# Altium schematic sheet Compute 5 Top Configuration.SchDoc
size A3; SheetNumber: 7; SheetTotal: 7
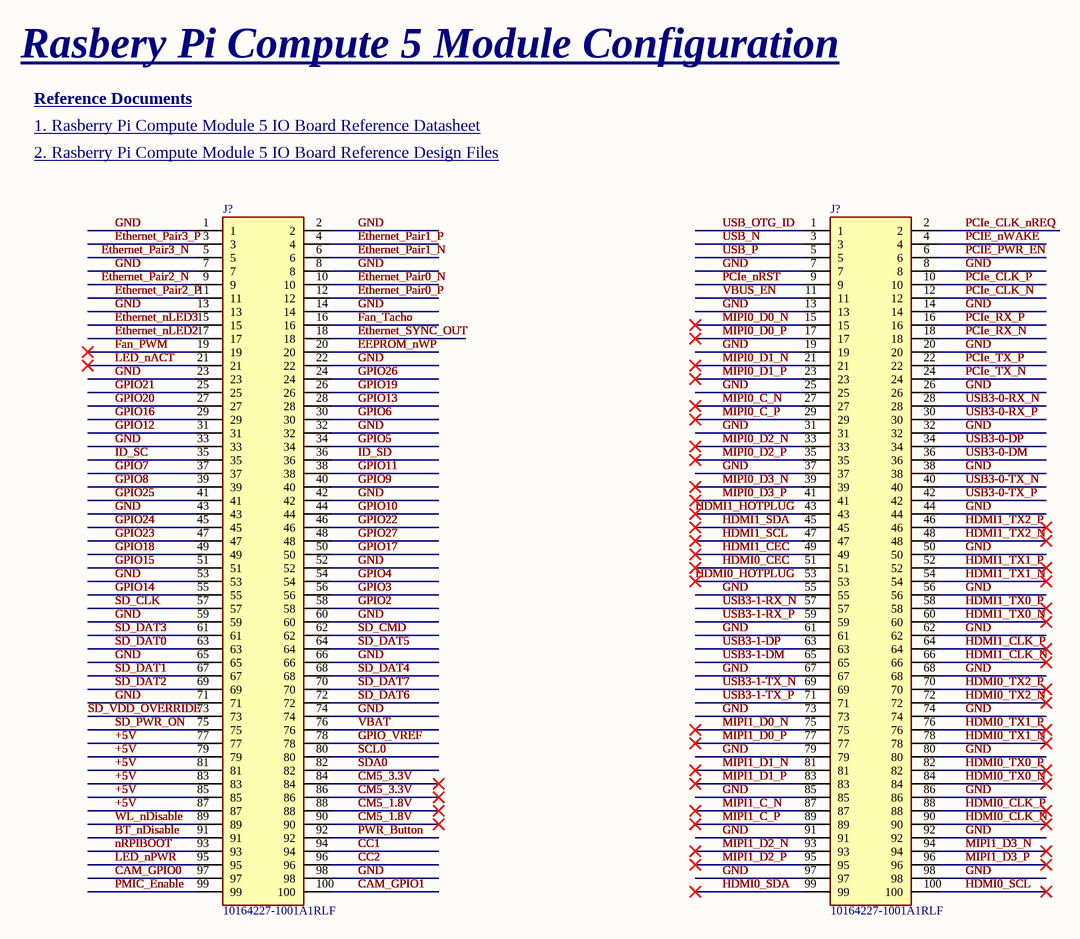
[diagram p0: Compute 5 Top Configuration.SchDoc]

## Parts
(Parts that share a designator on the sheet are numbered #1, #2 ... from top to bottom, then left to right.)
J?#1  10164227-1001A1RLF  [101642271001A1RLF]
J?#2  10164227-1001A1RLF  [101642271001A1RLF]

## Nets
+5V: J?#1.77 J?#1.79 J?#1.81 J?#1.83 J?#1.85 J?#1.87
BT_nDisable: J?#1.91
CAM_GPIO0: J?#1.97
CAM_GPIO1: J?#1.100
CC1: J?#1.94
CC2: J?#1.96
CM5_1.8V: J?#1.88 J?#1.90
CM5_3.3V: J?#1.84 J?#1.86
EEPROM_nWP: J?#1.20
Ethernet_nLED2: J?#1.17
Ethernet_nLED3: J?#1.15
Ethernet_Pair0_N: J?#1.10
Ethernet_Pair0_P: J?#1.12
Ethernet_Pair1_N: J?#1.6
Ethernet_Pair1_P: J?#1.4
Ethernet_Pair2_N: J?#1.9
Ethernet_Pair2_P: J?#1.11
Ethernet_Pair3_N: J?#1.5
Ethernet_Pair3_P: J?#1.3
Ethernet_SYNC_OUT: J?#1.18
Fan_PWM: J?#1.19
Fan_Tacho: J?#1.16
GND: J?#1.1 J?#1.2 J?#1.7 J?#1.8 J?#1.13 J?#1.14 J?#1.22 J?#1.23 J?#1.32 J?#1.33 J?#1.42 J?#1.43 J?#1.52 J?#1.53 J?#1.59 J?#1.60 J?#1.65 J?#1.66 J?#1.71 J?#1.74 J?#1.98 J?#2.7 J?#2.8 J?#2.13 J?#2.14 J?#2.19 J?#2.20 J?#2.25 J?#2.26 J?#2.31 J?#2.32 J?#2.37 J?#2.38 J?#2.44 J?#2.50 J?#2.55 J?#2.56 J?#2.61 J?#2.62 J?#2.67 J?#2.68 J?#2.73 J?#2.74 J?#2.79 J?#2.80 J?#2.85 J?#2.86 J?#2.91 J?#2.92 J?#2.97 J?#2.98
GPIO2: J?#1.58
GPIO3: J?#1.56
GPIO4: J?#1.54
GPIO5: J?#1.34
GPIO6: J?#1.30
GPIO7: J?#1.37
GPIO8: J?#1.39
GPIO9: J?#1.40
GPIO10: J?#1.44
GPIO11: J?#1.38
GPIO12: J?#1.31
GPIO13: J?#1.28
GPIO14: J?#1.55
GPIO15: J?#1.51
GPIO16: J?#1.29
GPIO17: J?#1.50
GPIO18: J?#1.49
GPIO19: J?#1.26
GPIO20: J?#1.27
GPIO21: J?#1.25
GPIO22: J?#1.46
GPIO23: J?#1.47
GPIO24: J?#1.45
GPIO25: J?#1.41
GPIO26: J?#1.24
GPIO27: J?#1.48
GPIO_VREF: J?#1.78
HDMI0_CEC: J?#2.51
HDMI0_CLK_N: J?#2.90
HDMI0_CLK_P: J?#2.88
HDMI0_HOTPLUG: J?#2.53
HDMI0_SCL: J?#2.100
HDMI0_SDA: J?#2.99
HDMI0_TX0_N: J?#2.84
HDMI0_TX0_P: J?#2.82
HDMI0_TX1_N: J?#2.78
HDMI0_TX1_P: J?#2.76
HDMI0_TX2_N: J?#2.72
HDMI0_TX2_P: J?#2.70
HDMI1_CEC: J?#2.49
HDMI1_CLK_N: J?#2.66
HDMI1_CLK_P: J?#2.64
HDMI1_HOTPLUG: J?#2.43
HDMI1_SCL: J?#2.47
HDMI1_SDA: J?#2.45
HDMI1_TX0_N: J?#2.60
HDMI1_TX0_P: J?#2.58
HDMI1_TX1_N: J?#2.54
HDMI1_TX1_P: J?#2.52
HDMI1_TX2_N: J?#2.48
HDMI1_TX2_P: J?#2.46
ID_SC: J?#1.35
ID_SD: J?#1.36
LED_nACT: J?#1.21
LED_nPWR: J?#1.95
MIPI0_C_N: J?#2.27
MIPI0_C_P: J?#2.29
MIPI0_D0_N: J?#2.15
MIPI0_D0_P: J?#2.17
MIPI0_D1_N: J?#2.21
MIPI0_D1_P: J?#2.23
MIPI0_D2_N: J?#2.33
MIPI0_D2_P: J?#2.35
MIPI0_D3_N: J?#2.39
MIPI0_D3_P: J?#2.41
MIPI1_C_N: J?#2.87
MIPI1_C_P: J?#2.89
MIPI1_D0_N: J?#2.75
MIPI1_D0_P: J?#2.77
MIPI1_D1_N: J?#2.81
MIPI1_D1_P: J?#2.83
MIPI1_D2_N: J?#2.93
MIPI1_D2_P: J?#2.95
MIPI1_D3_N: J?#2.94
MIPI1_D3_P: J?#2.96
nRPIBOOT: J?#1.93
PCIe_CLK_N: J?#2.12
PCIe_CLK_nREQ: J?#2.2
PCIe_CLK_P: J?#2.10
PCIe_nRST: J?#2.9
PCIE_nWAKE: J?#2.4
PCIE_PWR_EN: J?#2.6
PCIe_RX_N: J?#2.18
PCIe_RX_P: J?#2.16
PCIe_TX_N: J?#2.24
PCIe_TX_P: J?#2.22
PMIC_Enable: J?#1.99
PWR_Button: J?#1.92
SCL0: J?#1.80
SD_CLK: J?#1.57
SD_CMD: J?#1.62
SD_DAT0: J?#1.63
SD_DAT1: J?#1.67
SD_DAT2: J?#1.69
SD_DAT3: J?#1.61
SD_DAT4: J?#1.68
SD_DAT5: J?#1.64
SD_DAT6: J?#1.72
SD_DAT7: J?#1.70
SD_PWR_ON: J?#1.75
SD_VDD_OVERRIDE: J?#1.73
SDA0: J?#1.82
USB3-0-DM: J?#2.36
USB3-0-DP: J?#2.34
USB3-0-RX_N: J?#2.28
USB3-0-RX_P: J?#2.30
USB3-0-TX_N: J?#2.40
USB3-0-TX_P: J?#2.42
USB3-1-DM: J?#2.65
USB3-1-DP: J?#2.63
USB3-1-RX_N: J?#2.57
USB3-1-RX_P: J?#2.59
USB3-1-TX_N: J?#2.69
USB3-1-TX_P: J?#2.71
USB_N: J?#2.3
USB_OTG_ID: J?#2.1
USB_P: J?#2.5
VBAT: J?#1.76
VBUS_EN: J?#2.11
WL_nDisable: J?#1.89

## Notes on the sheet
- Rasbery Pi Compute 5 Module Configuration
- Reference Documents
- 1. Rasberry Pi Compute Module 5 IO Board Reference Datasheet <https://datasheets.raspberrypi.com/cm5/cm5io-datasheet.pdf>
- 2. Rasberry Pi Compute Module 5 IO Board Reference Design Files <https://pip.raspberrypi.com/categories/1098-design-files>

## Library data of the parts
J?#1 J?#2 = 10164227-1001A1RLF: Connector; Manufacturer_Name: Amphenol; Datasheet Link: https://cdn.amphenol-cs.com/media/wysiwyg/files/drawing/10164227.pdf; Height: 1.65mm; Manufacturer_Part_Number: 10164227-1001A1RLF; Mouser Part Number: 649-01642271001A1RLF; Mouser Price/Stock: https://www.mouser.co.uk/ProductDetail/Amphenol-FCI/10164227-1001A1RLF?qs=MyNHzdoqoQIc%2Fqhi8q%2FTOw%3D%3D